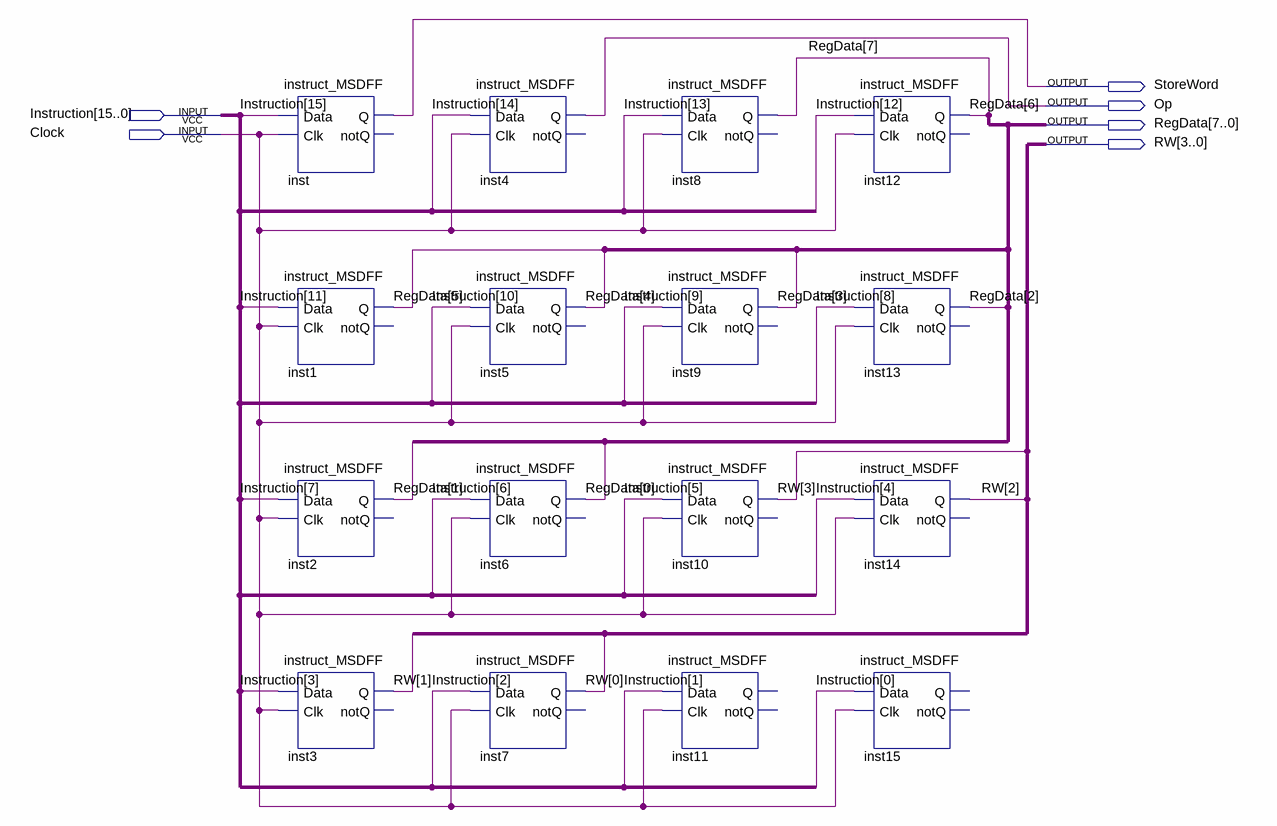
[diagram p0: schematic sheet]
// Quartus schematic instruction_register.bdf as structural Verilog: 16 symbols, 6 pins
module instruction_register (
  input  [15:0] Instruction,
  input  Clock,
  output StoreWord,
  output Op,
  output [7:0] RegData,
  output [3:0] RW
);

  instruct_MSDFF inst (.Data(Instruction[15]), .Clk(Clock), .Q(StoreWord));  // open: notQ
  instruct_MSDFF inst1 (.Data(Instruction[11]), .Clk(Clock), .Q(RegData[5]));  // open: notQ
  instruct_MSDFF inst2 (.Data(Instruction[7]), .Clk(Clock), .Q(RegData[1]));  // open: notQ
  instruct_MSDFF inst3 (.Data(Instruction[3]), .Clk(Clock), .Q(RW[1]));  // open: notQ
  instruct_MSDFF inst4 (.Data(Instruction[14]), .Clk(Clock), .Q(Op));  // open: notQ
  instruct_MSDFF inst5 (.Data(Instruction[10]), .Clk(Clock), .Q(RegData[4]));  // open: notQ
  instruct_MSDFF inst6 (.Data(Instruction[6]), .Clk(Clock), .Q(RegData[0]));  // open: notQ
  instruct_MSDFF inst7 (.Data(Instruction[2]), .Clk(Clock), .Q(RW[0]));  // open: notQ
  instruct_MSDFF inst8 (.Data(Instruction[13]), .Clk(Clock), .Q(RegData[7]));  // open: notQ
  instruct_MSDFF inst9 (.Data(Instruction[9]), .Clk(Clock), .Q(RegData[3]));  // open: notQ
  instruct_MSDFF inst10 (.Data(Instruction[5]), .Clk(Clock), .Q(RW[3]));  // open: notQ
  instruct_MSDFF inst11 (.Data(Instruction[1]), .Clk(Clock));  // open: Q, notQ
  instruct_MSDFF inst12 (.Data(Instruction[12]), .Clk(Clock), .Q(RegData[6]));  // open: notQ
  instruct_MSDFF inst13 (.Data(Instruction[8]), .Clk(Clock), .Q(RegData[2]));  // open: notQ
  instruct_MSDFF inst14 (.Data(Instruction[4]), .Clk(Clock), .Q(RW[2]));  // open: notQ
  instruct_MSDFF inst15 (.Data(Instruction[0]), .Clk(Clock));  // open: Q, notQ
endmodule
